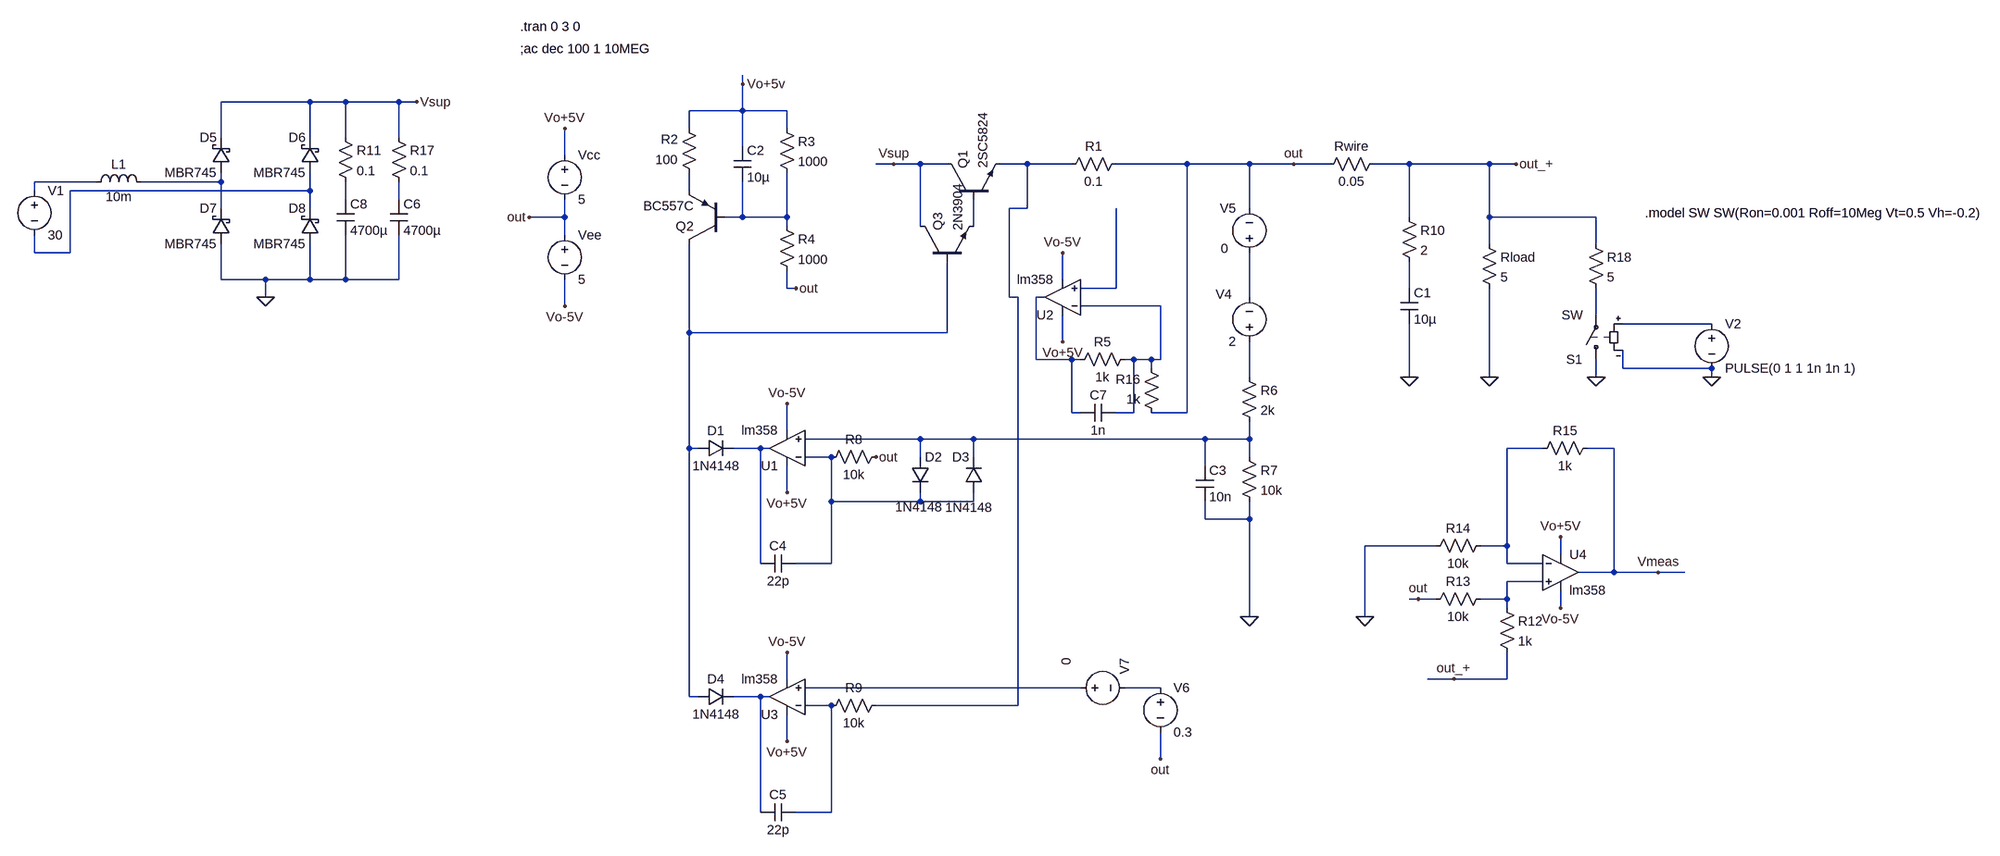
[diagram p0: schematic reg_LM358_shunt_amp.asc]
reg_LM358_shunt_amp.asc, the LTspice schematic file:
Version 4
SHEET 1 2108 1300
WIRE -176 -80 -176 -96
WIRE -1056 -48 -1216 -48
WIRE -992 -48 -1056 -48
WIRE -896 -48 -992 -48
WIRE -864 -48 -896 -48
WIRE -176 -32 -176 -80
WIRE -176 -32 -272 -32
WIRE -96 -32 -176 -32
WIRE -272 0 -272 -32
WIRE -96 0 -96 -32
WIRE -1216 16 -1216 -48
WIRE -1056 16 -1056 -48
WIRE -992 16 -992 -48
WIRE -896 16 -896 -48
WIRE -176 32 -176 -32
WIRE -496 48 -496 0
WIRE 96 64 64 64
WIRE 144 64 96 64
WIRE 192 64 144 64
WIRE 336 64 288 64
WIRE 416 64 336 64
WIRE 624 64 496 64
WIRE 736 64 624 64
WIRE 816 64 736 64
WIRE 880 64 816 64
WIRE 1024 64 960 64
WIRE 1168 64 1024 64
WIRE 1216 64 1168 64
WIRE -1440 96 -1552 96
WIRE -1216 96 -1216 80
WIRE -1216 96 -1360 96
WIRE -1552 112 -1552 96
WIRE -1056 112 -1056 80
WIRE -1056 112 -1488 112
WIRE -272 112 -272 80
WIRE -992 128 -992 96
WIRE -896 128 -896 96
WIRE -1216 144 -1216 96
WIRE -1056 144 -1056 112
WIRE 336 144 336 64
WIRE 336 144 304 144
WIRE 736 144 736 64
WIRE -496 160 -496 128
WIRE -496 160 -560 160
WIRE -176 160 -176 96
WIRE -176 160 -208 160
WIRE -96 160 -96 80
WIRE -96 160 -176 160
WIRE 1024 160 1024 64
WIRE 1168 160 1168 64
WIRE 1360 160 1168 160
WIRE -96 176 -96 160
WIRE 144 176 144 64
WIRE 240 176 240 128
WIRE -496 192 -496 160
WIRE 1168 208 1168 160
WIRE 1360 208 1360 160
WIRE -1552 224 -1552 192
WIRE -1488 224 -1488 112
WIRE -1488 224 -1552 224
WIRE -1216 272 -1216 208
WIRE -1136 272 -1216 272
WIRE -1056 272 -1056 208
WIRE -1056 272 -1136 272
WIRE -992 272 -992 192
WIRE -992 272 -1056 272
WIRE -896 272 -896 192
WIRE -896 272 -992 272
WIRE 400 272 400 224
WIRE -96 288 -96 256
WIRE -80 288 -96 288
WIRE 496 288 496 144
WIRE 496 288 432 288
WIRE 1024 288 1024 240
WIRE -1136 304 -1136 272
WIRE 304 304 304 144
WIRE 320 304 304 304
WIRE 368 304 352 304
WIRE 736 304 736 224
WIRE -496 320 -496 272
WIRE 576 320 432 320
WIRE 1360 336 1360 288
WIRE 1568 352 1408 352
WIRE -272 368 -272 208
WIRE 192 368 192 240
WIRE 192 368 -272 368
WIRE 400 384 400 336
WIRE 352 416 352 304
WIRE 416 416 352 416
WIRE 432 416 416 416
WIRE 528 416 512 416
WIRE 560 416 528 416
WIRE 576 416 576 320
WIRE 576 416 560 416
WIRE 560 432 560 416
WIRE 1408 432 1408 400
WIRE 1568 432 1408 432
WIRE 736 448 736 384
WIRE 1024 448 1024 352
WIRE 1168 448 1168 288
WIRE 1360 448 1360 416
WIRE 1568 448 1568 432
WIRE 416 512 416 416
WIRE 432 512 416 512
WIRE 528 512 528 416
WIRE 528 512 496 512
WIRE 624 512 624 64
WIRE 624 512 560 512
WIRE -96 544 -96 496
WIRE 144 560 -64 560
WIRE 240 560 144 560
WIRE 656 560 240 560
WIRE 736 560 736 528
WIRE 736 560 656 560
WIRE -272 576 -272 368
WIRE -256 576 -272 576
WIRE -144 576 -192 576
WIRE -128 576 -144 576
WIRE 1264 576 1200 576
WIRE 1392 576 1344 576
WIRE -16 592 -64 592
WIRE 144 592 144 560
WIRE 240 592 240 560
WIRE 736 592 736 560
WIRE 656 608 656 560
WIRE -96 656 -96 608
WIRE -16 672 -16 592
WIRE 144 672 144 656
WIRE 144 672 -16 672
WIRE 240 672 240 656
WIRE 240 672 144 672
WIRE 656 704 656 672
WIRE 736 704 736 672
WIRE 736 704 656 704
WIRE 1072 752 944 752
WIRE 1200 752 1200 576
WIRE 1200 752 1152 752
WIRE 1296 768 1296 736
WIRE -144 784 -144 576
WIRE -16 784 -16 672
WIRE -16 784 -80 784
WIRE 1200 784 1200 752
WIRE 1264 784 1200 784
WIRE 1392 800 1392 576
WIRE 1392 800 1328 800
WIRE 1472 800 1392 800
WIRE 1520 800 1472 800
WIRE 1264 816 1200 816
WIRE 1040 848 1024 848
WIRE 1072 848 1040 848
WIRE 1200 848 1200 816
WIRE 1200 848 1152 848
WIRE 1200 864 1200 848
WIRE 1296 864 1296 832
WIRE 736 880 736 704
WIRE 944 880 944 752
WIRE -96 992 -96 944
WIRE 1104 992 1056 992
WIRE 1200 992 1200 944
WIRE 1200 992 1104 992
WIRE 432 1008 -64 1008
WIRE 576 1008 512 1008
WIRE -272 1024 -272 576
WIRE -256 1024 -272 1024
WIRE -144 1024 -192 1024
WIRE -128 1024 -144 1024
WIRE -16 1040 -64 1040
WIRE 320 1040 320 304
WIRE 320 1040 64 1040
WIRE -96 1104 -96 1056
WIRE 576 1136 576 1088
WIRE -144 1232 -144 1024
WIRE -16 1232 -16 1040
WIRE -16 1232 -80 1232
FLAG 816 64 out
FLAG -80 288 out
FLAG -560 160 out
FLAG -496 320 Vo-5V
FLAG -496 0 Vo+5V
FLAG -176 -80 Vo+5v
FLAG 1024 448 0
FLAG 1168 448 0
FLAG -96 656 Vo+5V
FLAG -96 496 Vo-5V
FLAG 736 880 0
FLAG 64 592 out
FLAG -96 1104 Vo+5V
FLAG -96 944 Vo-5V
FLAG 576 1136 out
FLAG -864 -48 Vsup
FLAG -1136 304 0
FLAG 1296 736 Vo+5V
FLAG 1296 864 Vo-5V
FLAG 1040 848 out
FLAG 1104 992 out_+
FLAG 1216 64 out_+
FLAG 96 64 Vsup
FLAG 944 880 0
FLAG 1472 800 Vmeas
FLAG 400 384 Vo+5V
FLAG 400 224 Vo-5V
FLAG 1360 448 0
FLAG 1568 448 0
SYMBOL npn 192 128 R270
WINDOW 0 55 29 Left 2
WINDOW 3 56 65 Left 2
SYMATTR InstName Q1
SYMATTR Value 2SC5824
SYMBOL res 512 48 R90
WINDOW 0 0 56 VBottom 2
WINDOW 3 32 56 VTop 2
SYMATTR InstName R1
SYMATTR Value 0.1
SYMBOL res -256 96 R180
WINDOW 0 36 76 Left 2
WINDOW 3 36 40 Left 2
SYMATTR InstName R2
SYMATTR Value 100
SYMBOL pnp -208 208 R180
SYMATTR InstName Q2
SYMATTR Value BC557C
SYMBOL res -112 -16 R0
SYMATTR InstName R3
SYMATTR Value 1000
SYMBOL res -112 160 R0
SYMATTR InstName R4
SYMATTR Value 1000
SYMBOL voltage -496 32 R0
WINDOW 123 0 0 Left 0
WINDOW 39 0 0 Left 0
SYMATTR InstName Vcc
SYMATTR Value 5
SYMBOL voltage -496 176 R0
WINDOW 123 0 0 Left 0
WINDOW 39 0 0 Left 0
SYMATTR InstName Vee
SYMATTR Value 5
SYMBOL res 1152 192 R0
SYMATTR InstName Rload
SYMATTR Value 5
SYMBOL cap 1008 288 R0
SYMATTR InstName C1
SYMATTR Value 10µ
SYMBOL diode -256 592 R270
WINDOW 0 32 32 VTop 2
WINDOW 3 0 32 VBottom 2
SYMATTR InstName D1
SYMATTR Value 1N4148
SYMBOL voltage 736 400 R180
WINDOW 0 31 101 Left 2
WINDOW 3 24 16 Left 2
WINDOW 123 0 0 Left 0
WINDOW 39 0 0 Left 0
SYMATTR InstName V4
SYMATTR Value 2
SYMBOL res 720 432 R0
SYMATTR InstName R6
SYMATTR Value 2k
SYMBOL res 720 576 R0
SYMATTR InstName R7
SYMATTR Value 10k
SYMBOL cap -192 32 R0
SYMATTR InstName C2
SYMATTR Value 10µ
SYMATTR SpiceLine Rser=2
SYMBOL cap 640 608 R0
SYMATTR InstName C3
SYMATTR Value 10n
SYMBOL cap -80 768 R90
WINDOW 0 0 32 VBottom 2
WINDOW 3 32 32 VTop 2
SYMATTR InstName C4
SYMATTR Value 22p
SYMATTR SpiceLine Rser=1
SYMBOL voltage 736 240 R180
WINDOW 0 24 96 Left 2
WINDOW 3 38 24 Left 2
WINDOW 123 28 -32 Left 2
WINDOW 39 0 0 Left 0
SYMATTR InstName V5
SYMATTR Value 0
SYMBOL diode 128 592 R0
WINDOW 3 61 91 Left 2
SYMATTR Value 1N4148
SYMATTR InstName D2
SYMBOL diode 256 656 R180
WINDOW 0 24 64 Left 2
WINDOW 3 72 -26 Left 2
SYMATTR InstName D3
SYMATTR Value 1N4148
SYMBOL res 80 576 R90
WINDOW 0 0 56 VBottom 2
WINDOW 3 32 56 VTop 2
SYMATTR InstName R8
SYMATTR Value 10k
SYMBOL diode -256 1040 R270
WINDOW 0 32 32 VTop 2
WINDOW 3 0 32 VBottom 2
SYMATTR InstName D4
SYMATTR Value 1N4148
SYMBOL cap -80 1216 R90
WINDOW 0 0 32 VBottom 2
WINDOW 3 32 32 VTop 2
SYMATTR InstName C5
SYMATTR Value 22p
SYMATTR SpiceLine Rser=1
SYMBOL res 80 1024 R90
WINDOW 0 0 56 VBottom 2
WINDOW 3 32 56 VTop 2
SYMATTR InstName R9
SYMATTR Value 10k
SYMBOL voltage 576 992 R0
WINDOW 123 0 0 Left 0
WINDOW 39 0 0 Left 0
SYMATTR InstName V6
SYMATTR Value 0.3
SYMBOL npn 144 240 R270
SYMATTR InstName Q3
SYMATTR Value 2N3904
SYMBOL voltage -1552 96 R0
WINDOW 123 0 0 Left 0
WINDOW 39 0 0 Left 0
SYMATTR InstName V1
SYMATTR Value 30
SYMBOL schottky -1040 80 R180
WINDOW 0 24 64 Left 2
WINDOW 3 24 0 Left 2
SYMATTR InstName D6
SYMATTR Value MBR745
SYMATTR Description Diode
SYMATTR Type diode
SYMBOL cap -912 128 R0
SYMATTR InstName C6
SYMATTR Value 4700µ
SYMATTR SpiceLine Rser=1m
SYMBOL ind -1456 112 R270
WINDOW 0 32 56 VTop 2
WINDOW 3 5 56 VBottom 2
SYMATTR InstName L1
SYMATTR Value 10m
SYMATTR SpiceLine Rser=10m
SYMBOL voltage 416 1008 R270
WINDOW 0 24 96 Left 2
WINDOW 3 41 -9 Left 2
WINDOW 123 41 19 Left 2
WINDOW 39 0 0 Left 0
SYMATTR InstName V7
SYMATTR Value 0
SYMBOL lm358 -96 1088 R180
WINDOW 0 16 32 Left 2
WINDOW 38 -88 114 Left 2
SYMATTR InstName U3
SYMBOL lm358 1296 736 R0
WINDOW 0 16 32 Left 2
WINDOW 38 26 92 Left 2
SYMATTR InstName U4
SYMBOL res 1184 848 R0
SYMATTR InstName R12
SYMATTR Value 1k
SYMBOL res 1168 832 R90
WINDOW 0 0 56 VBottom 2
WINDOW 3 32 56 VTop 2
SYMATTR InstName R13
SYMATTR Value 10k
SYMBOL res 1168 736 R90
WINDOW 0 0 56 VBottom 2
WINDOW 3 32 56 VTop 2
SYMATTR InstName R14
SYMATTR Value 10k
SYMBOL res 1360 560 R90
WINDOW 0 0 56 VBottom 2
WINDOW 3 32 56 VTop 2
SYMATTR InstName R15
SYMATTR Value 1k
SYMBOL res 976 48 R90
WINDOW 0 0 56 VBottom 2
WINDOW 3 32 56 VTop 2
SYMATTR InstName Rwire
SYMATTR Value 0.05
SYMBOL res 1008 144 R0
SYMATTR InstName R10
SYMATTR Value 2
SYMBOL schottky -1200 80 R180
WINDOW 0 24 64 Left 2
WINDOW 3 24 0 Left 2
SYMATTR InstName D5
SYMATTR Value MBR745
SYMATTR Description Diode
SYMATTR Type diode
SYMBOL schottky -1200 208 R180
WINDOW 0 24 64 Left 2
WINDOW 3 24 0 Left 2
SYMATTR InstName D7
SYMATTR Value MBR745
SYMATTR Description Diode
SYMATTR Type diode
SYMBOL schottky -1040 208 R180
WINDOW 0 24 64 Left 2
WINDOW 3 24 0 Left 2
SYMATTR InstName D8
SYMATTR Value MBR745
SYMATTR Description Diode
SYMATTR Type diode
SYMBOL cap -1008 128 R0
SYMATTR InstName C8
SYMATTR Value 4700µ
SYMBOL res -1008 0 R0
SYMATTR InstName R11
SYMATTR Value 0.1
SYMBOL res -912 0 R0
SYMATTR InstName R17
SYMATTR Value 0.1
SYMBOL lm358 -96 640 R180
WINDOW 0 16 32 Left 2
WINDOW 38 -84 124 Left 2
SYMATTR InstName U1
SYMBOL lm358 400 368 R180
WINDOW 0 16 32 Left 2
WINDOW 38 -84 124 Left 2
SYMATTR InstName U2
SYMBOL res 528 400 R90
WINDOW 0 0 56 VBottom 2
WINDOW 3 32 56 VTop 2
SYMATTR InstName R5
SYMATTR Value 1k
SYMBOL res 576 528 R180
WINDOW 0 36 76 Left 2
WINDOW 3 36 40 Left 2
SYMATTR InstName R16
SYMATTR Value 1k
SYMBOL cap 496 496 R90
WINDOW 0 0 32 VBottom 2
WINDOW 3 32 32 VTop 2
SYMATTR InstName C7
SYMATTR Value 1n
SYMBOL sw 1360 432 R180
SYMATTR InstName S1
SYMBOL voltage 1568 336 R0
WINDOW 123 0 0 Left 0
WINDOW 39 0 0 Left 0
SYMATTR InstName V2
SYMATTR Value PULSE(0 1 1 1n 1n 1)
SYMBOL res 1344 192 R0
SYMATTR InstName R18
SYMATTR Value 5
TEXT -576 -144 Left 2 !;ac dec 100 1 10MEG
TEXT -576 -184 Left 2 !.tran 0 3 0
TEXT 1448 152 Left 2 !.model SW SW(Ron=0.001 Roff=10Meg Vt=0.5 Vh=-0.2)

The netlist it stands for:
* reg_LM358_shunt_amp.asc
Q1 Vsup N009 N001 0 2SC5824
R1 out N001 0.1
R2 N005 Vo+5V 100
Q2 N017 N008 N005 0 BC557C
R3 Vo+5V N008 1000
R4 N008 out 1000
Vcc Vo+5V out 5
Vee out Vo-5V 5
Rload out_+ 0 5
C1 N011 0 10µ
D1 N017 N020 1N4148
V4 N018 N013 2
R6 N018 N019 2k
R7 N019 0 10k
C2 Vo+5V N008 10µ Rser=2
C3 N019 0 10n
C4 N022 N020 22p Rser=1
V5 N013 out 0
D2 N019 N022 1N4148
D3 N022 N019 1N4148
R8 out N022 10k
D4 N017 N026 1N4148
C5 N027 N026 22p Rser=1
R9 N001 N027 10k
V6 N025 out 0.3
Q3 Vsup N017 N009 0 2N3904
V1 N002 N004 30
D6 N004 Vsup MBR745
C6 N007 0 4700µ Rser=1m
L1 N002 N003 10m Rser=10m
V7 N024 N025 0
* U3: lm358 (symbol lm358 not available, pins judged from their places): In+=N024 In-=N027 V+=Vo+5V V-=Vo-5V OUT=N026
* U4: lm358 (symbol lm358 not available, pins judged from their places): In+=N023 In-=N021 V+=Vo+5V V-=Vo-5V OUT=Vmeas
R12 N023 out_+ 1k
R13 N023 out 10k
R14 N021 0 10k
R15 Vmeas N021 1k
Rwire out_+ out 0.05
R10 out_+ N011 2
D5 N003 Vsup MBR745
D7 0 N003 MBR745
D8 0 N004 MBR745
C8 N006 0 4700µ
R11 Vsup N006 0.1
R17 Vsup N007 0.1
* U1: lm358 (symbol lm358 not available, pins judged from their places): In+=N019 In-=N022 V+=Vo+5V V-=Vo-5V OUT=N020
* U2: lm358 (symbol lm358 not available, pins judged from their places): In+=N010 In-=N014 V+=Vo+5V V-=Vo-5V OUT=N012
R5 N014 N012 1k
R16 out N014 1k
C7 N014 N012 1n
S1 0 N015 N016 0 SW
V2 N016 0 PULSE(0 1 1 1n 1n 1)
R18 out_+ N015 5
.model D D
.lib standard.dio
.model NPN NPN
.model PNP PNP
.lib standard.bjt
;ac dec 100 1 10MEG
.tran 0 3 0
.model SW SW(Ron=0.001 Roff=10Meg Vt=0.5 Vh=-0.2)
.backanno
.end